# Altium schematic sheet Ausgangsstufe.SchDoc
size A2
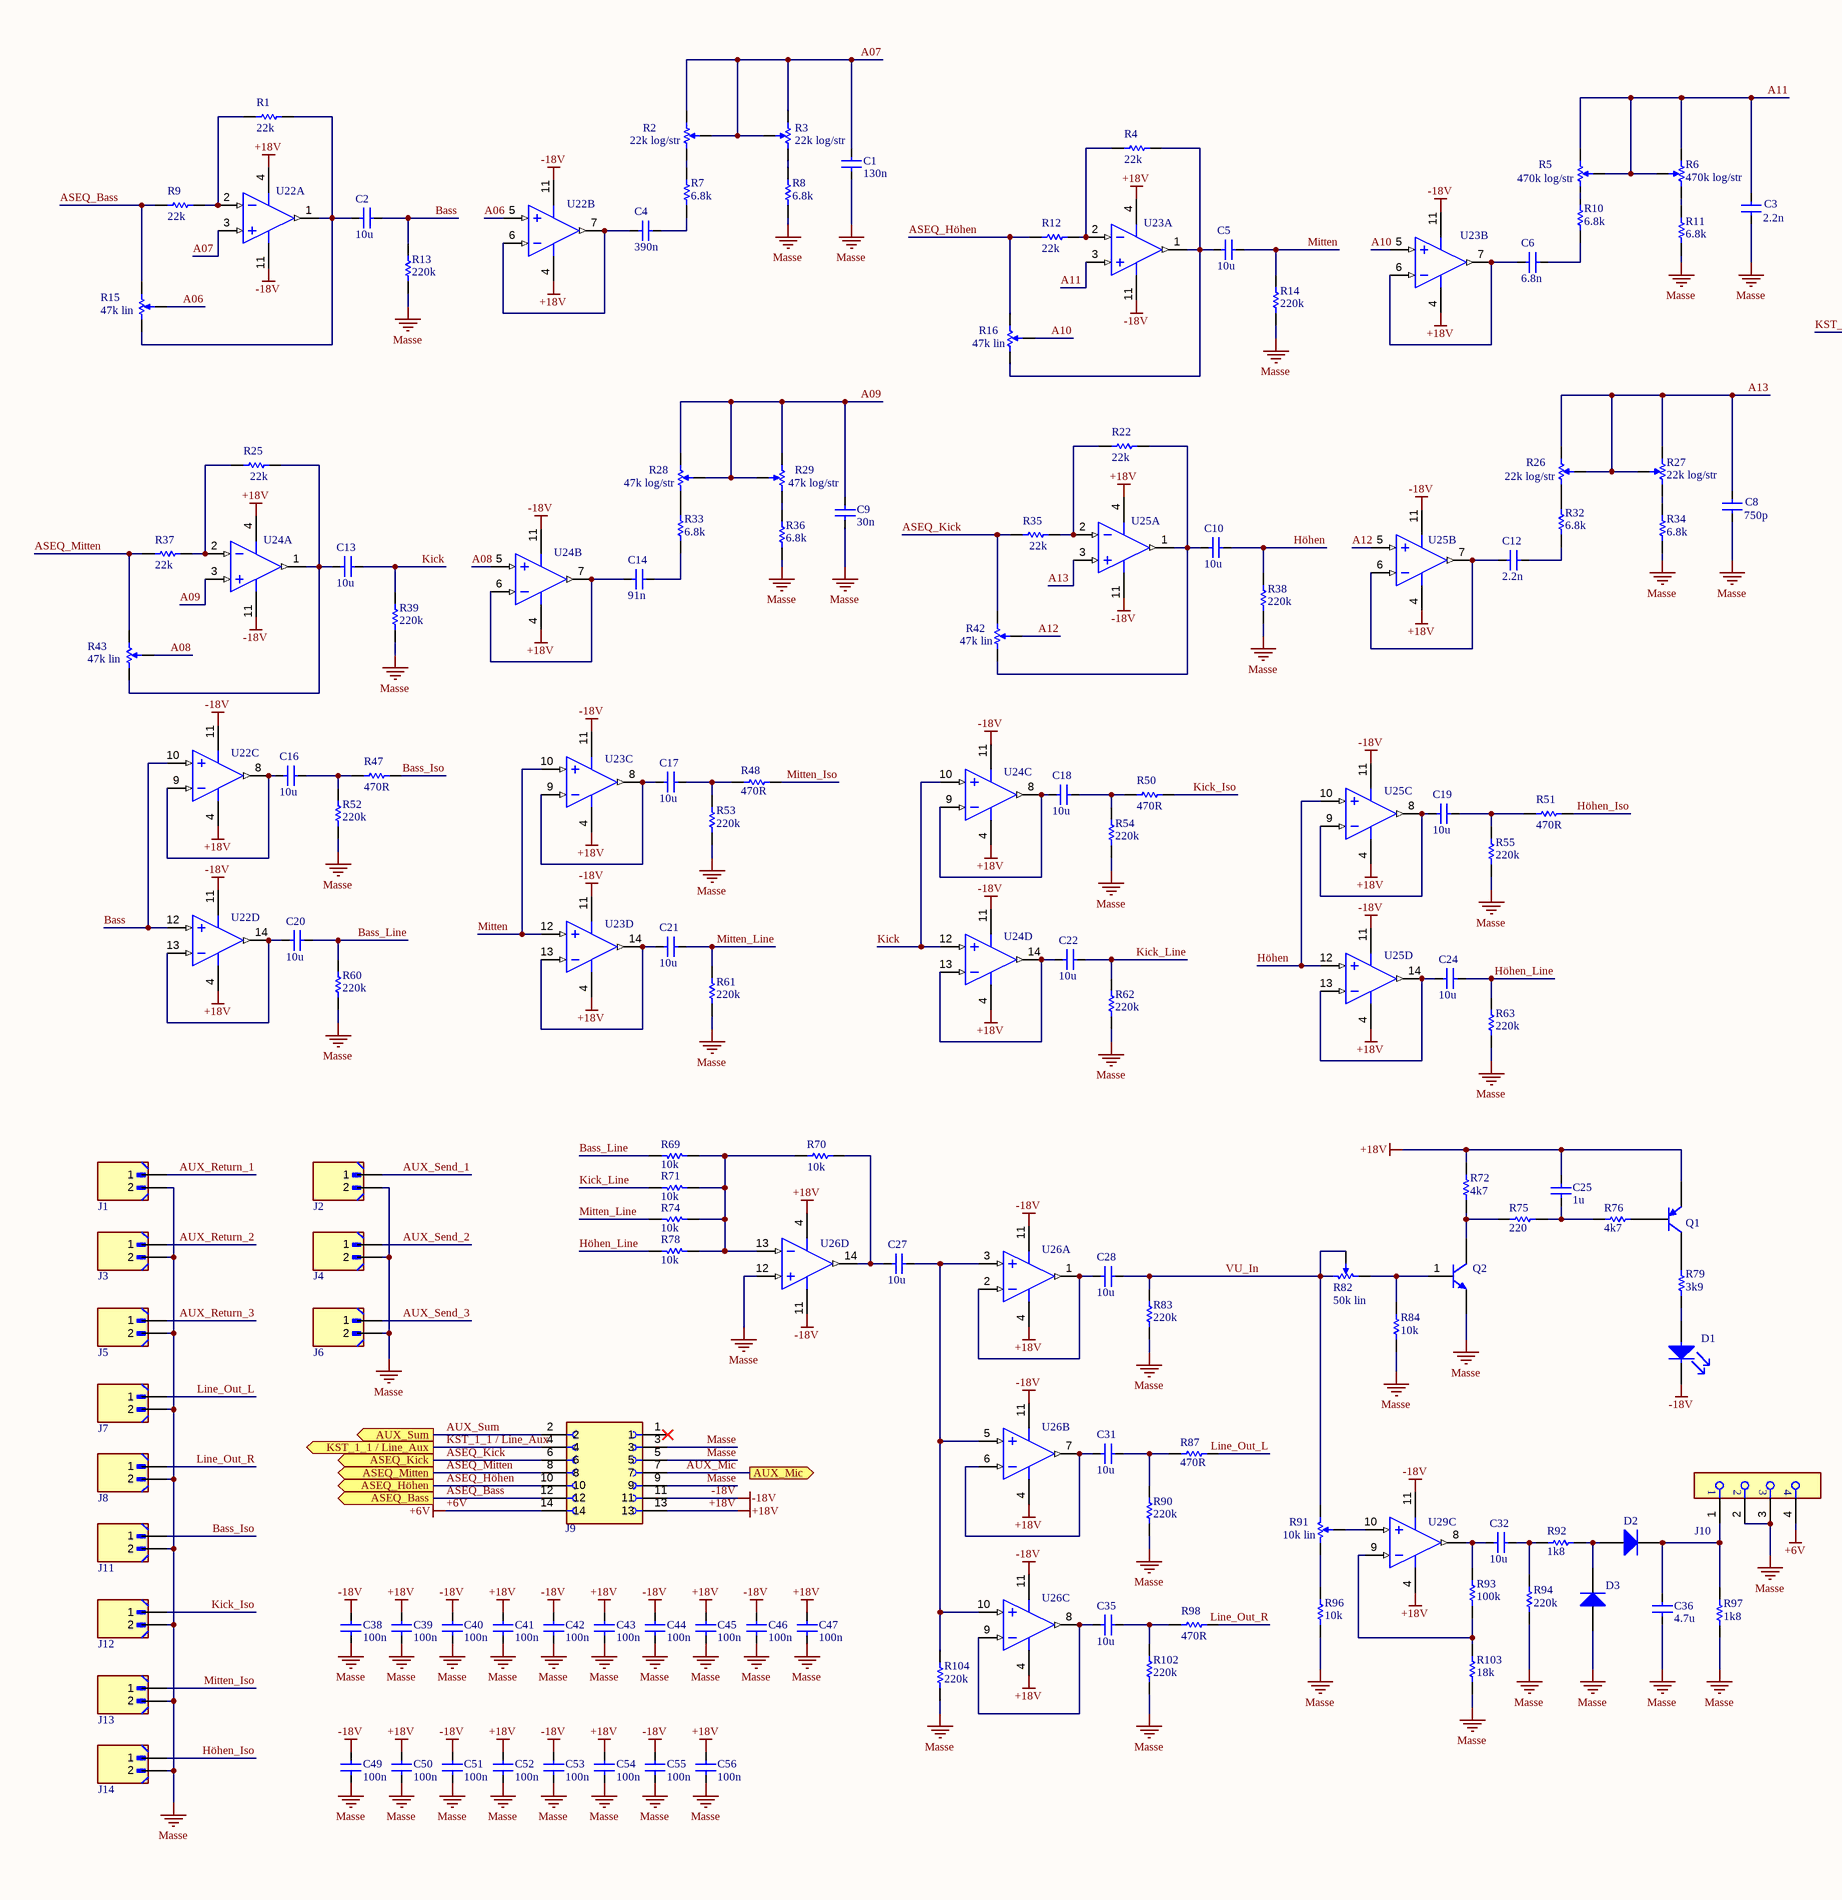
[diagram p0: Ausgangsstufe.SchDoc, left]
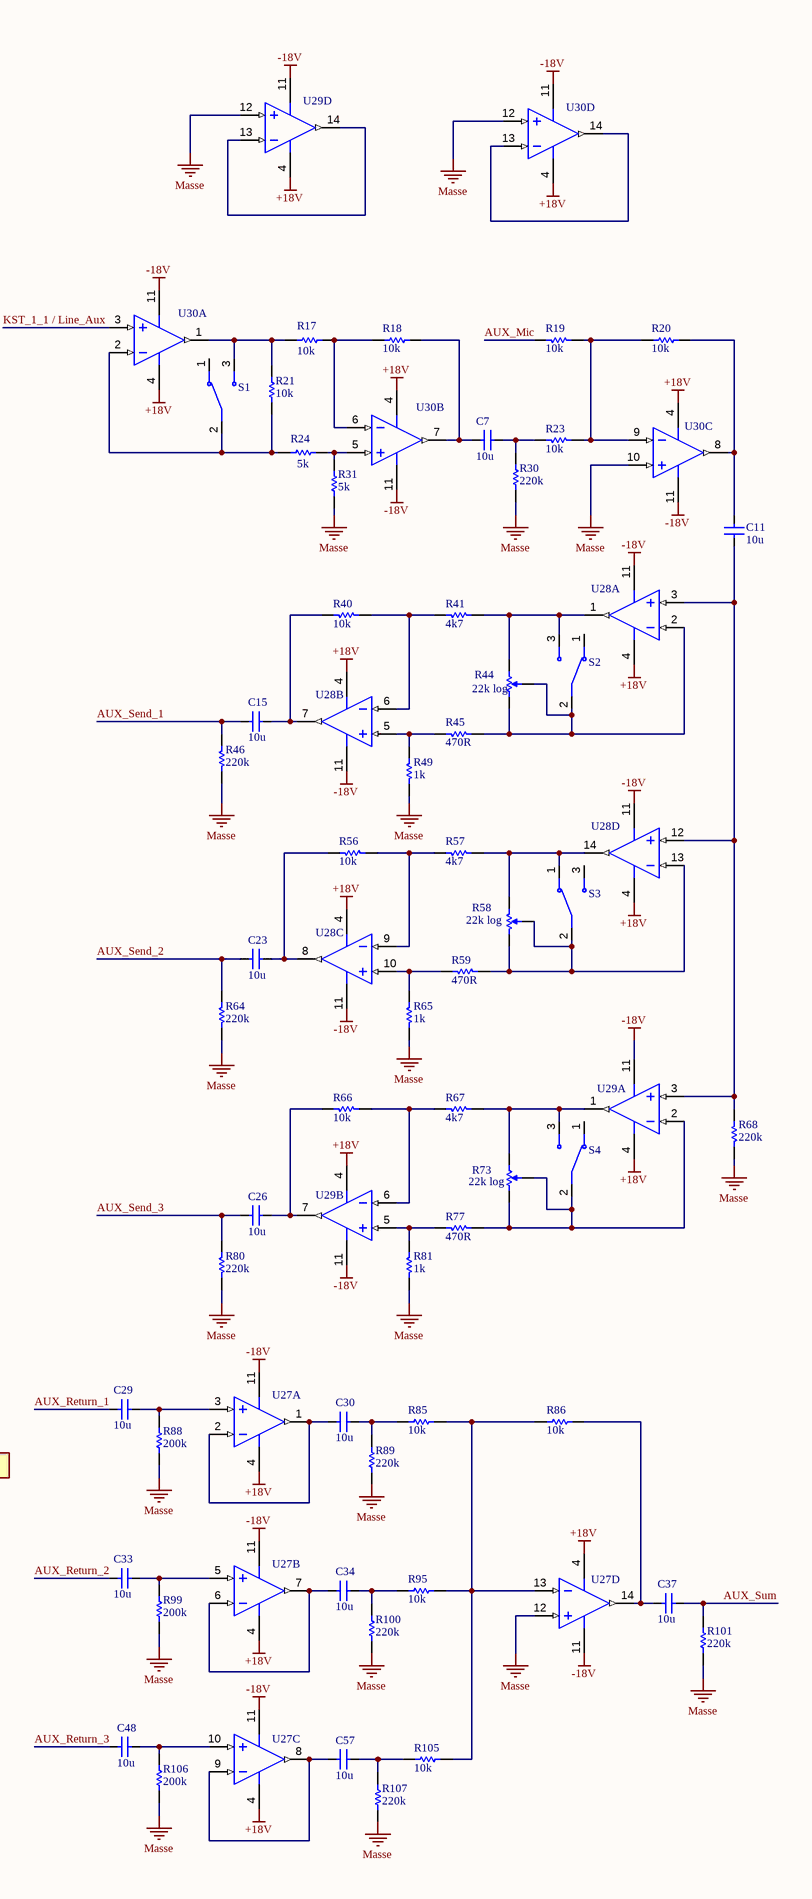
[diagram p1: Ausgangsstufe.SchDoc, right]

## Parts
C1  130n  [0805]
C2  10u  [0805]
C3  2.2n  [0805]
C4  390n  [0805]
C5  10u  [0805]
C6  6.8n  [0805]
C7  10u  [0805]
C8  750p  [0805]
C9  30n  [0805]
C10  10u  [0805]
C11  10u  [0805]
C12  2.2n  [0805]
C13  10u  [0805]
C14  91n  [0805]
C15  10u  [0805]
C16  10u  [0805]
C17  10u  [0805]
C18  10u  [0805]
C19  10u  [0805]
C20  10u  [0805]
C21  10u  [0805]
C22  10u  [0805]
C23  10u  [0805]
C24  10u  [0805]
C25  1u  [0805]
C26  10u  [0805]
C27  10u  [0805]
C28  10u  [0805]
C29  10u  [0805]
C30  10u  [0805]
C31  10u  [0805]
C32  10u  [0805]
C33  10u  [0805]
C34  10u  [0805]
C35  10u  [0805]
C36  4.7u  [0805]
C37  10u  [0805]
C38  100n  [0805]
C39  100n  [0805]
C40  100n  [0805]
C41  100n  [0805]
C42  100n  [0805]
C43  100n  [0805]
C44  100n  [0805]
C45  100n  [0805]
C46  100n  [0805]
C47  100n  [0805]
C48  10u  [0805]
C49  100n  [0805]
C50  100n  [0805]
C51  100n  [0805]
C52  100n  [0805]
C53  100n  [0805]
C54  100n  [0805]
C55  100n  [0805]
C56  100n  [0805]
C57  10u  [0805]
D1  WP710A10LGD  [Connector x2]  (value not drawn)
D2  1N4148WS-7-F  [1N4148 Diode]  (value not drawn)
D3  1N4148WS-7-F  [1N4148 Diode]  (value not drawn)
J1  Connector x2  [Connector x2]  (value not drawn)
J2  Connector x2  [Connector x2]  (value not drawn)
J3  Connector x2  [Connector x2]  (value not drawn)
J4  Connector x2  [Connector x2]  (value not drawn)
J5  Connector x2  [Connector x2]  (value not drawn)
J6  Connector x2  [Connector x2]  (value not drawn)
J7  Connector x2  [Connector x2]  (value not drawn)
J8  Connector x2  [Connector x2]  (value not drawn)
J9  Connector x14  [Connector x14]  (value not drawn)
J10  VU Meter  [Connector x4]  (value not drawn)
J11  Connector x2  [Connector x2]  (value not drawn)
J12  Connector x2  [Connector x2]  (value not drawn)
J13  Connector x2  [Connector x2]  (value not drawn)
J14  Connector x2  [Connector x2]  (value not drawn)
Q1  BC807-40LT1G  [SOT23 Transistor]  (value not drawn)
Q2  BC817-40,215  [SOT23 Transistor]  (value not drawn)
R1  22k  [0805]
R2  22k log/str  [Connector x3]
R3  22k log/str  [Connector x3]
R4  22k  [0805]
R5  470k log/str  [Connector x3]
R6  470k log/str  [Connector x3]
R7  6.8k  [0805]
R8  6.8k  [0805]
R9  22k  [0805]
R10  6.8k  [0805]
R11  6.8k  [0805]
R12  22k  [0805]
R13  220k  [0805]
R14  220k  [0805]
R15  47k lin  [Connector x3]
R16  47k lin  [Connector x3]
R17  10k  [0805]
R18  10k  [0805]
R19  10k  [0805]
R20  10k  [0805]
R21  10k  [0805]
R22  22k  [0805]
R23  10k  [0805]
R24  5k  [0805]
R25  22k  [0805]
R26  22k log/str  [Connector x3]
R27  22k log/str  [Connector x3]
R28  47k log/str  [Connector x3]
R29  47k log/str  [Connector x3]
R30  220k  [0805]
R31  5k  [0805]
R32  6.8k  [0805]
R33  6.8k  [0805]
R34  6.8k  [0805]
R35  22k  [0805]
R36  6.8k  [0805]
R37  22k  [0805]
R38  220k  [0805]
R39  220k  [0805]
R40  10k  [0805]
R41  4k7  [0805]
R42  47k lin  [Connector x3]
R43  47k lin  [Connector x3]
R44  22k log  [Connector x3]
R45  470R  [0805]
R46  220k  [0805]
R47  470R  [0805]
R48  470R  [0805]
R49  1k  [0805]
R50  470R  [0805]
R51  470R  [0805]
R52  220k  [0805]
R53  220k  [0805]
R54  220k  [0805]
R55  220k  [0805]
R56  10k  [0805]
R57  4k7  [0805]
R58  22k log  [Connector x3]
R59  470R  [0805]
R60  220k  [0805]
R61  220k  [0805]
R62  220k  [0805]
R63  220k  [0805]
R64  220k  [0805]
R65  1k  [0805]
R66  10k  [0805]
R67  4k7  [0805]
R68  220k  [0805]
R69  10k  [0805]
R70  10k  [0805]
R71  10k  [0805]
R72  4k7  [0805]
R73  22k log  [Connector x3]
R74  10k  [0805]
R75  220  [0805]
R76  4k7  [0805]
R77  470R  [0805]
R78  10k  [0805]
R79  3k9  [0805]
R80  220k  [0805]
R81  1k  [0805]
R82  50k lin  [SMD Trimmer 3314G]
R83  220k  [0805]
R84  10k  [0805]
R85  10k  [0805]
R86  10k  [0805]
R87  470R  [0805]
R88  200k  [0805]
R89  220k  [0805]
R90  220k  [0805]
R91  10k lin  [SMD Trimmer 3314G]
R92  1k8  [0805]
R93  100k  [0805]
R94  220k  [0805]
R95  10k  [0805]
R96  10k  [0805]
R97  1k8  [0805]
R98  470R  [0805]
R99  200k  [0805]
R100  220k  [0805]
R101  220k  [0805]
R102  220k  [0805]
R103  18k  [0805]
R104  220k  [0805]
R105  10k  [0805]
R106  200k  [0805]
R107  220k  [0805]
S1  Schalter Buchsenleiste  [Connector x3]  (value not drawn)
S2  Schalter Buchsenleiste  [Connector x3]  (value not drawn)
S3  Schalter Buchsenleiste  [Connector x3]  (value not drawn)
S4  Schalter Buchsenleiste  [Connector x3]  (value not drawn)
U22  OPA4134UA  [DIP14 IC Socket]  (value not drawn)  (parts A,B,C,D of 4)
U23  OPA4134UA  [DIP14 IC Socket]  (value not drawn)  (parts A,B,C,D of 4)
U24  OPA4134UA  [DIP14 IC Socket]  (value not drawn)  (parts A,B,C,D of 4)
U25  OPA4134UA  [DIP14 IC Socket]  (value not drawn)  (parts A,B,C,D of 4)
U26  OPA4134UA  [DIP14 IC Socket]  (value not drawn)  (parts A,B,C,D of 4)
U27  OPA4134UA  [DIP14 IC Socket]  (value not drawn)  (parts A,B,C,D of 4)
U28  OPA4134UA  [DIP14 IC Socket]  (value not drawn)  (parts A,B,C,D of 4)
U29  OPA4134UA  [DIP14 IC Socket]  (value not drawn)  (parts A,B,C,D of 4)
U30  OPA4134UA  [DIP14 IC Socket]  (value not drawn)  (parts A,B,C,D of 4)

## Ports
ASEQ_Bass (out), ASEQ_Höhen (out), ASEQ_Kick (out), ASEQ_Mitten (out), AUX_Mic (out), AUX_Sum (out), KST_1_1 / Line_Aux (out)

## Nets
+6V: J9.14 J10.4
+18V: C25.2 C39.2 C41.2 C43.2 C45.2 C47.2 C50.2 C52.2 C54.2 C56.2 J9.13 Q1.2(E) R72.2 U22.4(V+) U23.4(V+) U24.4(V+) U25.4(V+) U26.4(V+) U27.4(V+) U28.4(V+) U29.4(V+) U30.4(V+)
-18V: C38.2 C40.2 C42.2 C44.2 C46.2 C49.2 C51.2 C53.2 C55.2 D1.2(K) J9.11 U22.11(V-) U23.11(V-) U24.11(V-) U25.11(V-) U26.11(V-) U27.11(V-) U28.11(V-) U29.11(V-) U30.11(V-)
Masse: C1.1 C3.1 C8.1 C9.1 C36.1 C38.1 C39.1 C40.1 C41.1 C42.1 C43.1 C44.1 C45.1 C46.1 C47.1 C49.1 C50.1 C51.1 C52.1 C53.1 C54.1 C55.1 C56.1 D3.1(A) J1.2 J2.2 J3.2 J4.2 J5.2 J6.2 J7.2 J8.2 J9.3 J9.5 J9.9 J10.2 J10.3 J11.2 J12.2 J13.2 J14.2 Q2.2(E) R8.1 R11.1 R13.1 R14.1 R30.1 R31.1 R34.1 R36.1 R38.1 R39.1 R46.1 R49.1 R52.1 R53.1 R54.1 R55.1 R60.1 R61.1 R62.1 R63.1 R64.1 R65.1 R68.1 R80.1 R81.1 R83.1 R84.1 R88.1 R89.2 R90.1 R94.1 R96.1 R97.2 R99.1 R100.2 R101.1 R102.1 R103.1 R104.1 R106.1 R107.2 U26.12(IN_D+) U27.12(IN_D+) U29.12(IN_D+) U30.10(IN_C+) U30.12(IN_D+)
A06: R15.2 U22.5(IN_B+)
A07: C1.2 R2.2 R2.3 R3.1 R3.2 U22.3(IN_A+)
A08: R43.2 U24.5(IN_B+)
A09: C9.2 R28.2 R28.3 R29.1 R29.2 U24.3(IN_A+)
A10: R16.2 U23.5(IN_B+)
A11: C3.2 R5.2 R5.3 R6.1 R6.2 U23.3(IN_A+)
A12: R42.2 U25.5(IN_B+)
A13: C8.2 R26.2 R26.3 R27.1 R27.2 U25.3(IN_A+)
ASEQ_Bass: J9.12 R9.1 R15.3 ; port ASEQ_Bass
ASEQ_Höhen: J9.10 R12.1 R16.3 ; port ASEQ_Höhen
ASEQ_Kick: J9.6 R35.1 R42.3 ; port ASEQ_Kick
ASEQ_Mitten: J9.8 R37.1 R43.3 ; port ASEQ_Mitten
AUX_Mic: J9.7 R19.2 ; port AUX_Mic
AUX_Return_1: C29.1 J1.1
AUX_Return_2: C33.1 J3.1
AUX_Return_3: C48.2 J5.1
AUX_Send_1: C15.2 J2.1 R46.2
AUX_Send_2: C23.2 J4.1 R64.2
AUX_Send_3: C26.2 J6.1 R80.2
AUX_Sum: C37.2 J9.2 R101.2 ; port AUX_Sum
Bass: C2.2 R13.2 U22.10(IN_C+) U22.12(IN_D+)
Bass_Iso: J11.1 R47.2
Bass_Line: C20.2 R60.2 R69.1
Höhen: C10.2 R38.2 U25.10(IN_C+) U25.12(IN_D+)
Höhen_Iso: J14.1 R51.2
Höhen_Line: C24.2 R63.2 R78.1
Kick: C13.2 R39.2 U24.10(IN_C+) U24.12(IN_D+)
Kick_Iso: J12.1 R50.2
Kick_Line: C22.2 R62.2 R71.1
KST_1_1 / Line_Aux: J9.4 U30.3(IN_A+) ; port KST_1_1 / Line_Aux
Line_Out_L: J7.1 R87.2
Line_Out_R: J8.1 R98.2
Mitten: C5.2 R14.2 U23.10(IN_C+) U23.12(IN_D+)
Mitten_Iso: J13.1 R48.2
Mitten_Line: C21.2 R61.2 R74.1
VU_In: C28.2 R82.1 R82.2 R83.2 R91.1
NetC2_1: C2.1 R1.2 R15.1 U22.1(OUT_A)
NetC4_1: C4.1 U22.6(IN_B-) U22.7(OUT_B)
NetC4_2: C4.2 R7.1
NetC5_1: C5.1 R4.2 R16.1 U23.1(OUT_A)
NetC6_1: C6.1 U23.6(IN_B-) U23.7(OUT_B)
NetC6_2: C6.2 R10.1
NetC7_1: C7.1 R18.2 U30.7(OUT_B)
NetC7_2: C7.2 R23.2 R30.2
NetC10_1: C10.1 R22.2 R42.1 U25.1(OUT_A)
NetC11_1: C11.1 R68.2 U28.3(IN_A+) U28.12(IN_D+) U29.3(IN_A+)
NetC11_2: C11.2 R20.2 U30.8(OUT_C)
NetC12_1: C12.1 U25.6(IN_B-) U25.7(OUT_B)
NetC12_2: C12.2 R32.1
NetC13_1: C13.1 R25.2 R43.1 U24.1(OUT_A)
NetC14_1: C14.1 U24.6(IN_B-) U24.7(OUT_B)
NetC14_2: C14.2 R33.1
NetC15_1: C15.1 R40.2 U28.7(OUT_B)
NetC16_1: C16.1 U22.8(OUT_C) U22.9(IN_C-)
NetC16_2: C16.2 R47.1 R52.2
NetC17_1: C17.1 U23.8(OUT_C) U23.9(IN_C-)
NetC17_2: C17.2 R48.1 R53.2
NetC18_1: C18.1 U24.8(OUT_C) U24.9(IN_C-)
NetC18_2: C18.2 R50.1 R54.2
NetC19_1: C19.1 U25.8(OUT_C) U25.9(IN_C-)
NetC19_2: C19.2 R51.1 R55.2
NetC20_1: C20.1 U22.13(IN_D-) U22.14(OUT_D)
NetC21_1: C21.1 U23.13(IN_D-) U23.14(OUT_D)
NetC22_1: C22.1 U24.13(IN_D-) U24.14(OUT_D)
NetC23_1: C23.1 R56.2 U28.8(OUT_C)
NetC24_1: C24.1 U25.13(IN_D-) U25.14(OUT_D)
NetC25_1: C25.1 R75.1 R76.2
NetC26_1: C26.1 R66.2 U29.7(OUT_B)
NetC27_1: C27.1 R70.2 U26.14(OUT_D)
NetC27_2: C27.2 R104.2 U26.3(IN_A+) U26.5(IN_B+) U26.10(IN_C+)
NetC28_1: C28.1 U26.1(OUT_A) U26.2(IN_A-)
NetC29_2: C29.2 R88.2 U27.3(IN_A+)
NetC30_1: C30.1 R85.2 R89.1
NetC30_2: C30.2 U27.1(OUT_A) U27.2(IN_A-)
NetC31_1: C31.1 U26.6(IN_B-) U26.7(OUT_B)
NetC31_2: C31.2 R87.1 R90.2
NetC32_1: C32.1 R93.2 U29.8(OUT_C)
NetC32_2: C32.2 R92.2 R94.2
NetC33_2: C33.2 R99.2 U27.5(IN_B+)
NetC34_1: C34.1 R95.2 R100.1
NetC34_2: C34.2 U27.6(IN_B-) U27.7(OUT_B)
NetC35_1: C35.1 U26.8(OUT_C) U26.9(IN_C-)
NetC35_2: C35.2 R98.1 R102.2
NetC36_2: C36.2 D2.2(K) J10.1 R97.1
NetC37_1: C37.1 R86.2 U27.14(OUT_D)
NetC48_1: C48.1 R106.2 U27.10(IN_C+)
NetC57_1: C57.1 R105.2 R107.1
NetC57_2: C57.2 U27.8(OUT_C) U27.9(IN_C-)
NetD1_1: D1.1(A) R79.2
NetD2_1: D2.1(A) D3.2(K) R92.1
NetQ1_1: Q1.1(B) R76.1
NetQ1_3: Q1.3(C) R79.1
NetQ2_1: Q2.1(B) R82.3 R84.2
NetQ2_3: Q2.3(C) R72.1 R75.2
NetR1_1: R1.1 R9.2 U22.2(IN_A-)
NetR2_1: R2.1 R7.2
NetR3_3: R3.3 R8.2
NetR4_1: R4.1 R12.2 U23.2(IN_A-)
NetR5_1: R5.1 R10.2
NetR6_3: R6.3 R11.2
NetR17_1: R17.1 R21.2 S1.3 U30.1(OUT_A)
NetR17_2: R17.2 R18.1 U30.6(IN_B-)
NetR19_1: R19.1 R20.1 R23.1 U30.9(IN_C-)
NetR21_1: R21.1 R24.1 S1.2 U30.2(IN_A-)
NetR22_1: R22.1 R35.2 U25.2(IN_A-)
NetR24_2: R24.2 R31.2 U30.5(IN_B+)
NetR25_1: R25.1 R37.2 U24.2(IN_A-)
NetR26_1: R26.1 R32.2
NetR27_3: R27.3 R34.2
NetR28_1: R28.1 R33.2
NetR29_3: R29.3 R36.2
NetR40_1: R40.1 R41.2 U28.6(IN_B-)
NetR41_1: R41.1 R44.3 S2.3 U28.1(OUT_A)
NetR44_1: R44.1 R44.2 R45.1 S2.2 U28.2(IN_A-)
NetR45_2: R45.2 R49.2 U28.5(IN_B+)
NetR56_1: R56.1 R57.2 U28.9(IN_C-)
NetR57_1: R57.1 R58.1 S3.1 U28.14(OUT_D)
NetR58_2: R58.2 R58.3 R59.1 S3.2 U28.13(IN_D-)
NetR59_2: R59.2 R65.2 U28.10(IN_C+)
NetR66_1: R66.1 R67.2 U29.6(IN_B-)
NetR67_1: R67.1 R73.3 S4.3 U29.1(OUT_A)
NetR69_2: R69.2 R70.1 R71.2 R74.2 R78.2 U26.13(IN_D-)
NetR73_1: R73.1 R73.2 R77.1 S4.2 U29.2(IN_A-)
NetR77_2: R77.2 R81.2 U29.5(IN_B+)
NetR85_1: R85.1 R86.1 R95.1 R105.1 U27.13(IN_D-)
NetR91_2: R91.2 U29.10(IN_C+)
NetR91_3: R91.3 R96.2
NetR93_1: R93.1 R103.2 U29.9(IN_C-)
NetU29_13: U29.13(IN_D-) U29.14(OUT_D)
NetU30_13: U30.13(IN_D-) U30.14(OUT_D)

Not connected (* = marked no-connect by the designer): J9 1*; S1 1; S2 1; S3 3; S4 1

## Notes on the sheet
- THIS DOCUMENT AND THE DATA DISCLOSED HEREIN OR
- HEREWITH IS THE PROPERTY OF ALTIUM LIMITED AND MAY
- DWG NO:
- REVISION
- REV:
- DESCRIPTION
- DATE
- APPROVED
- BE FREELY DISTRIBUTED IN WHOLE. NO RIGHTS ARE
- RESERVED OR EXPRESS OR IMPLIED WARANTEE GIVEN.
- ENG:
- APPROVALS
- PROJECT
- DSN:
- CHK:
- REFERENCE DOCUMENTS
- PROJECT REVISION:
- TITLE
- DOCUMENT REVISION:
- DESIGN ITEM:
- BOM:
- FAB DWG:
- PCB DWG:
- ASSY DWG:
- SCALE:
- A3
- SIZE
- CAGE CODE
- FILE NAME
- DWG NO.
- SHEET
- OF
- REV

## Library data of the parts
C1-C57 = 0805 Kondensator
  C1: Value: 130n
  C2 C5 C10 C13 C15-C24 C26-C28 C31 C35: Value: 10u
  C3 C12: Value: 2.2n
  C4: Value: 390n
  C6: Value: 6.8n
  C7 C11: Value: 10u; ClassName: KST/AUX
  C8: Value: 750p
  C9: Value: 30n
  C14: Value: 91n
  C25: Value: 1u
  C29 C30 C33 C34 C37 C48 C57: Value: 10u; ClassName: AUX_Return
  C32: Value: 10u; ClassName: VU_Meter
  C36: Value: 4.7u; ClassName: VU_Meter
  C38-C47 C49-C56: Value: 100n
D1 = LED Buchsenleiste: WP710A10LGD LED Thru-Hole PCB Green T-1 3mm Green Lens 2 mA 568 nm 2 mcd Round | Kingbright WP710A10LGD; NexarPartId: 20090258; Number of LEDs: 1; Max Junction Temperature (Tj): 110°C; Viewing Angle: 40°; Reverse Voltage: 5V; Forward Voltage: 1.9V; Dominant Wavelength: 568nm; Luminous Intensity: 2mcd; Power Rating: 62.5mW; Forward Current: 2mA; Lens Style: Diffused, Dome, Round, Tinted; Height: 4.6mm; Mount: Through Hole; Illumination Color: Green; Number of Pins: 3; RoHS: Compliant; Max Operating Temperature: 85°C; Min Operating Temperature: -40°C; Lens Color: Green; Wavelength: 568nm; Color: Green; Schedule B: 8541402000, 8541402000|8541402000|8541402000|8541402000|8541402000; Case/Package: Radial; Power Dissipation: 62.5mW; Lead Free: Lead Free; Test Current: 2mA
D2 D3 = 1N4148 Diode: Fast Switching Diode, 75 V, 0.3 A, -65 to 150 degC, 2-Pin SOD323, RoHS, Tape and Reel; DatasheetVersion: Rev. 25-2, 03/2016; PackageDescription: 2-Pin Small Outline Diode, Body 1.7 x 1.3 mm; ComponentLink2Description: Datasheet; ComponentLink1URL: http://www.diodes.com/; PackageReference: SOD323-2; ComponentLink2URL: http://www.diodes.com/datasheets/ds30097.pdf; ComponentLink1Description: Manufacturer URL; ClassName: VU_Meter
J1-J8 J11-J14 = Connector x2: Connector Header Through Hole 2 position 0.100 (2.54mm); MF: Wurth Elektronik; MP: 61300211121; SnapEDA_Link: https://www.snapeda.com/parts/61300211121/Wurth+Elektronik/view-part/?ref=snap; Package: None; Value: *; Check_prices: https://www.snapeda.com/parts/61300211121/Wurth+Elektronik/view-part/?ref=eda
J9 = Connector x14: 14 Position Header Connector Through Hole; MF: Sullins Connector; MP: SFH11-PBPC-D07-ST-BK; Value: *; Check_prices: https://www.snapeda.com/parts/SFH11-PBPC-D07-ST-BK/Sullins%20Connector%20Solutions/view-part/851415/?ref=eda; Availability: Warning; Package: None; SnapEDA_Link: https://www.snapeda.com/parts/SFH11-PBPC-D07-ST-BK/Sullins%20Connector%20Solutions/view-part/851415/?ref=snap; Purchase-URL: https://pricing.snapeda.com/search/part/SFH11-PBPC-D07-ST-BK/?ref=eda; Price: None; System: Connector
J10 = Connector x4: CONN RCPT 4POS 0.1 GOLD PCB; Contact Resistance: 10mR; Number of Positions: 4; Pitch: 2.54mm; Gender: Female; Connector Type: Receptacle; Max Current Rating: 1A; Color: Black; Contact Material: Copper; Min Operating Temperature: -55°C; Max Operating Temperature: 125°C; Radiation Hardening: No; Termination: Solder; Depth: 2.54mm; Contact Plating: Gold; Orientation: Straight; Housing Color: Black; Width: 2.54mm; RoHS Compliant: Yes; Lead Free: Lead Free; Mount: Through Hole; Series: SS; Length: 10.16mm; Packaging: Bulk; Package Quantity: 1; Housing Material: Polyester; Number of Contacts: 4; Number of Rows: 1; ClassName: VU_Meter
Q1 = SOT23 BC807 PNP: General Purpose Transistor, PNP Silicon, 3-Pin SOT-23, Pb-Free, Tape and Reel; Manufacturer: On Semiconductor; fT Min (MHz): 100; IC Continuous (A): -0.5; Mounting Technology: Surface Mount; ComponentLink3URL: http://www.onsemi.cn/pub_link/Collateral/318-08.PDF; PartNumber: BC807-40LT1G; DatasheetVersion: Rev. 10; RoHS: TRUE; ComponentLink1URL: http://www.onsemi.com/; ComponentLink2URL: http://www.onsemi.com/pub_link/Collateral/BC807-16LT1-D.PDF; ComponentLink1Description: Manufacturer URL; ComponentLink3Description: Package Specification; PackageVersion: Rev. AP, 11/2009; PackageReference: SOT-23-3-318-08; PackageDescription: 3-Pin Small Outline Transistor, Body 2.92 x 1.3 mm, Pitch 0.95 mm; Packing: Tape and Reel; Polarity: PNP; ComponentLink2Description: Datasheet
Q2 = SOT23 BC817 NPN: TRANS NPN 45V 0.5A SOT23; Manufacturer: Nexperia; Collector Emitter Saturation Voltage: 700mV; Power Dissipation: 250mW; Collector Base Voltage: 50V; Unity Gain Freq: 100MHz; Hfe Max: 600; Rthja Max: 500K/W; Emitter Base Voltage: 5V; Max Collector Current: 500mA; Hfe Testvce: 1V; Automotive Grade: Grade 0; Hfe Min: 250; Max Junction Temp: +150°C; Number Of Npn: 1; Hfe Testic: 100mA; Octopart: https://octopart.com/bc817-40%2C215-nexperia-78739081; Lead Free: Yes; Ipc Land Pattern Name: SOT95P230X100-3; Manufacturer Part Number: BC817-40,215; RoHS: TRUE; Collector Emitter Breakdown Voltage: 45V; Digikey Description: TRANS NPN 45V 0.5A SOT23; ComponentLink2URL: https://assets.nexperia.com/documents/data-sheet/BC817_SER.pdf; Temperature Range High: +150°C; Mouser Description: BC817 Series 45 V 500 mA 250 mW SMT NPN General-Purpose Transistor - SOT-23-; Device Class L3: BJTs; Temperature: to +150°C; Height: 1.1mm; Automotive: Yes; Ambient Temperature Range Low: -65°C; Package: SOT23; Collector Emitter Voltage: 45V; Category: Trans; ComponentLink2Description: Datasheet; Device Class L2: Transistors; Ambient Temperature Range High: +150°C; Number Of Elements: 1; Device Class L1: Discrete Semiconductors; Footprint Url: https://assets.nexperia.com/documents/outline-drawing/SOT23.pdf
R1 R4 R7-R14 R17-R25 R30-R41 R45-R57 R59-R72 R74-R81 R83-R90 R92-R107 = 0805 Widerstand
  R1 R4 R9 R12 R22 R25 R35 R37: Value: 22k
  R7 R8 R10 R11 R32-R34 R36: Value: 6.8k
  R13 R14 R38 R39 R46 R52-R55 R60-R64 R68 R80 R83 R90 R102 R104: Value: 220k
  R17-R21 R23: Value: 10k; ClassName: KST/AUX
  R24 R31: Value: 5k; ClassName: KST/AUX
  R30: Value: 220k; ClassName: KST/AUX
  R40 R56 R66 R69-R71 R74 R78 R84: Value: 10k
  R41 R57 R67 R72 R76: Value: 4k7
  R45 R47 R48 R50 R51 R59 R77 R87 R98: Value: 470R
  R49 R65 R81: Value: 1k
  R75: Value: 220
  R79: Value: 3k9
  R85 R86 R95 R105: Value: 10k; ClassName: AUX_Return
  R88 R99 R106: Value: 200k; ClassName: AUX_Return
  R89 R100 R101 R107: Value: 220k; ClassName: AUX_Return
  R92 R97: Value: 1k8; ClassName: VU_Meter
  R93: Value: 100k; ClassName: VU_Meter
  R94: Value: 220k; ClassName: VU_Meter
  R96: Value: 10k; ClassName: VU_Meter
  R103: Value: 18k; ClassName: VU_Meter
R2 R3 R5 R6 R15 R16 R26-R29 R42-R44 R58 R73 = Potentiometer Buchsenleiste: Potentiometer
  R2 R3 R26 R27: Value: 22k log/str
  R5 R6: Value: 470k log/str
  R15 R16 R42 R43: Value: 47k lin
  R28 R29: Value: 47k log/str
  R44 R58 R73: Value: 22k log
R82 R91 = SMD Trimmer 3314G: 4 mm Square Trimpot(R) Trimming Potentiometer, 5 KOhm, +/- 20%, 0.25 W, -55 to 125 degC, 3-Pin SMD, RoHS, Tape and Reel
  R82: Value: 50k lin
  R91: Value: 10k lin; ClassName: VU_Meter
S1-S4 = Schalter Buchsenleiste: Toggle Switch SPDT Through Hole; MP: 100SP1T1B4M2QE; Package: None; Price: None; Value: *; Availability: Unavailable
  S1: ClassName: KST/AUX
U22-U30 = SOIC OPA4134UA: SoundPlus(TM) High Performance Audio Operational Amplifier, 5 to 36 V, -55 to 125 degC, 14-pin SOIC (D14), Green (RoHS & no Sb/Br); Manufacturer: Texas Instruments; Vmax(V): 36; Number of Channels: 4; Iq per channel(Max)(mA): 5; GBW(Typ)(MHz): 8; DatasheetVersion: SBOS058; ComponentLink2URL: http://www.ti.com/general/docs/lit/getliterature.tsp?genericPartNumber=OPA4134&fileType=pdf; ComponentLink1URL: http://www.ti.com/; PackageDescription: 14-Pin Plastic Small Outline, Body 8.65 x 3.9 mm, Pitch 1.27 mm; SubFamily: Audio Operational Amplifier; Vmin(V): 5; ComponentLink2Description: Datasheet; PackageVersion: 4040047-5/M, 06/2011; Code_JEDEC: MS-012; PackageReference: D0014A; ComponentLink1Description: Manufacturer URL; Vn at Flatband(Typ)(nV/rtHz): 8; Eco-Plan: Green (RoHS & no Sb/Br); Mounting Technology: Surface Mount; ComponentLink3URL: http://www.ti.com/lit/ml/mpds177g/mpds177g.pdf; PartNumber: OPA4134UA; ComponentLink3Description: Package Specification
  U27: ClassName: AUX_Return
  U30: ClassName: KST/AUX